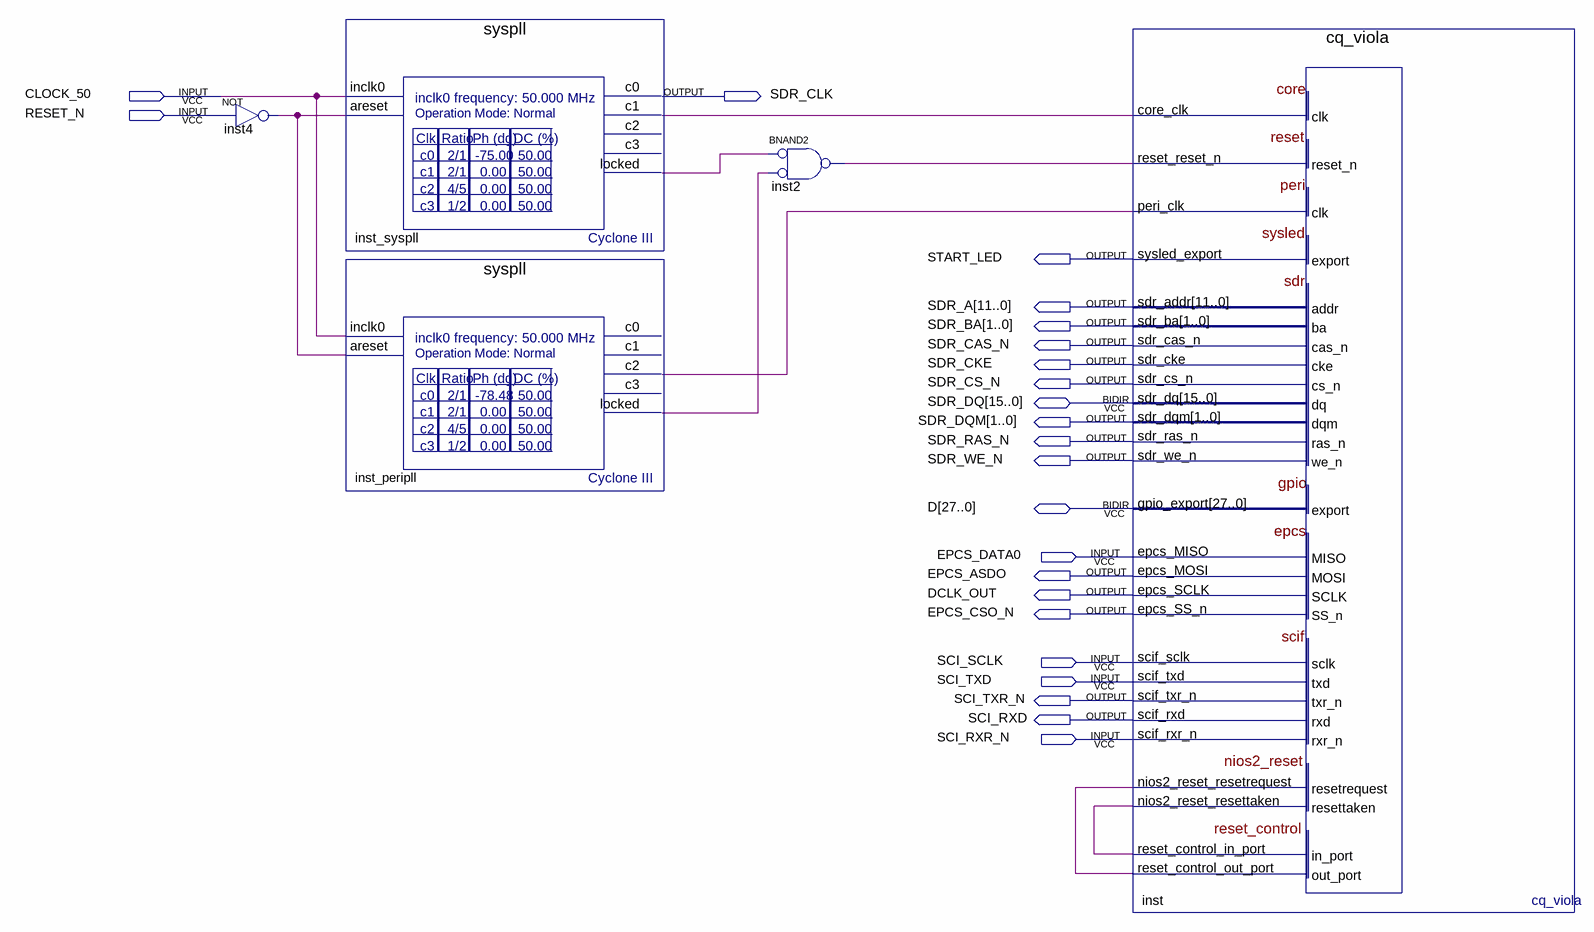
[diagram p0: schematic sheet]
// Quartus schematic testsuite.bdf as structural Verilog: 5 symbols, 23 pins
module testsuite (
  input  CLOCK_50,
  input  RESET_N,
  input  EPCS_DATA0,
  input  SCI_SCLK,
  input  SCI_TXD,
  input  SCI_RXR_N,
  inout  [15:0] SDR_DQ,
  inout  [27:0] D,
  output SDR_CLK,
  output START_LED,
  output [11:0] SDR_A,
  output [1:0] SDR_BA,
  output SDR_CAS_N,
  output SDR_CKE,
  output SDR_CS_N,
  output [1:0] SDR_DQM,
  output SDR_RAS_N,
  output SDR_WE_N,
  output EPCS_ASDO,
  output DCLK_OUT,
  output EPCS_CSO_N,
  output SCI_TXR_N,
  output SCI_RXD
);

  wire inst2_out, inst4_out, inst_nios2_reset_resettaken, inst_peripll_c2, inst_peripll_locked,
       inst_reset_control_out_port, inst_syspll_c1, inst_syspll_locked;

  not inst4 (inst4_out, RESET_N);
  syspll inst_syspll (
    .inclk0(CLOCK_50), .areset(inst4_out), .c0(SDR_CLK), .c1(inst_syspll_c1), .locked(inst_syspll_locked));  // open: c2, c3
  syspll inst_peripll (
    .inclk0(CLOCK_50), .areset(inst4_out), .c2(inst_peripll_c2), .locked(inst_peripll_locked));  // open: c0, c1, c3
  nand inst2 (inst2_out, ~inst_syspll_locked, ~inst_peripll_locked);  // BNAND2
  cq_viola inst (
    .core_clk(inst_syspll_c1), .reset_reset_n(inst2_out), .peri_clk(inst_peripll_c2), .epcs_MISO(EPCS_DATA0),
    .scif_sclk(SCI_SCLK), .scif_txd(SCI_TXD), .scif_rxr_n(SCI_RXR_N),
    .nios2_reset_resetrequest(inst_reset_control_out_port),
    .reset_control_in_port(inst_nios2_reset_resettaken), .sysled_export(START_LED), .sdr_addr(SDR_A),
    .sdr_ba(SDR_BA), .sdr_cas_n(SDR_CAS_N), .sdr_cke(SDR_CKE), .sdr_cs_n(SDR_CS_N), .sdr_dqm(SDR_DQM),
    .sdr_ras_n(SDR_RAS_N), .sdr_we_n(SDR_WE_N), .epcs_MOSI(EPCS_ASDO), .epcs_SCLK(DCLK_OUT),
    .epcs_SS_n(EPCS_CSO_N), .scif_txr_n(SCI_TXR_N), .scif_rxd(SCI_RXD),
    .nios2_reset_resettaken(inst_nios2_reset_resettaken),
    .reset_control_out_port(inst_reset_control_out_port), .sdr_dq(SDR_DQ), .gpio_export(D));
endmodule
